# EAGLE design FootSensor (EAGLE 9.6.2)
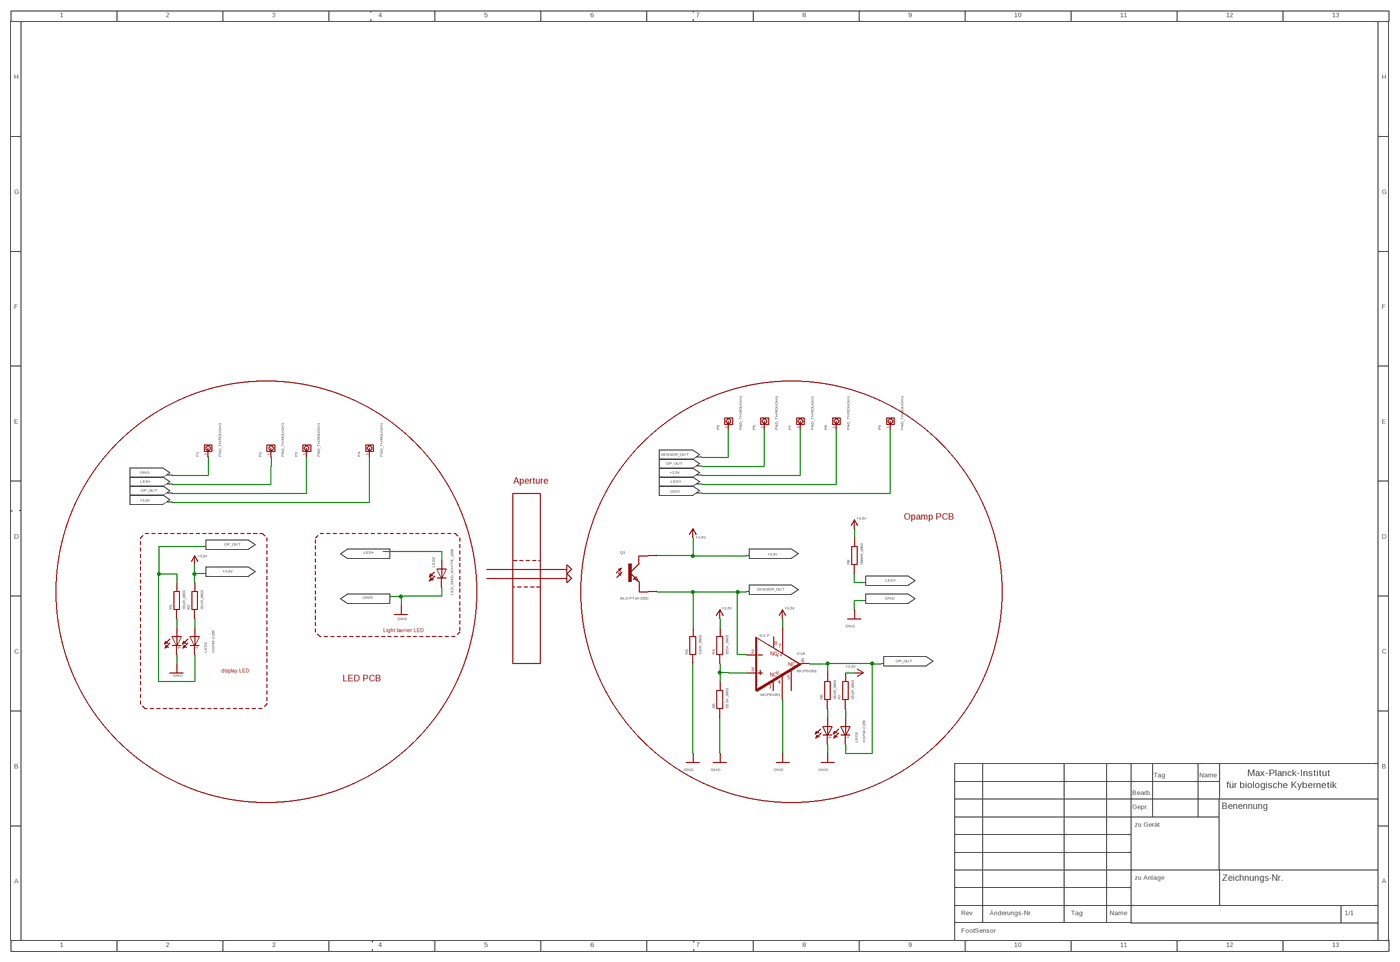
[diagram p0: schematic, sheet 1, overview]
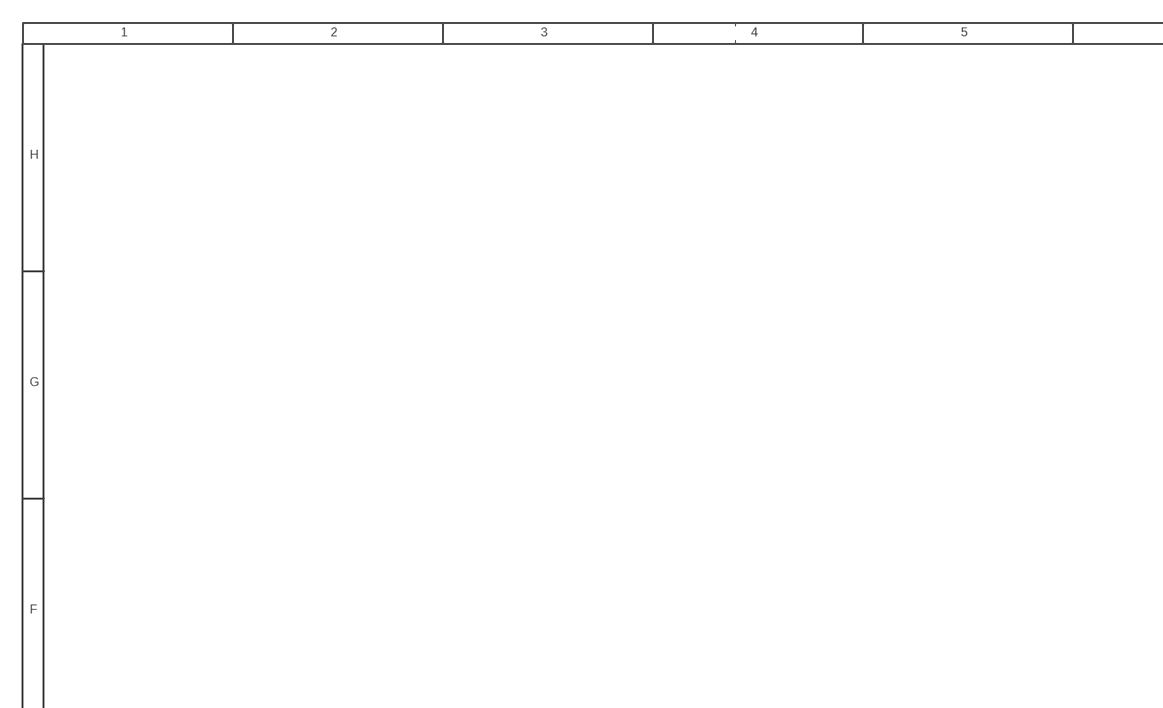
[diagram p1: schematic, sheet 1, part 1 of 4]
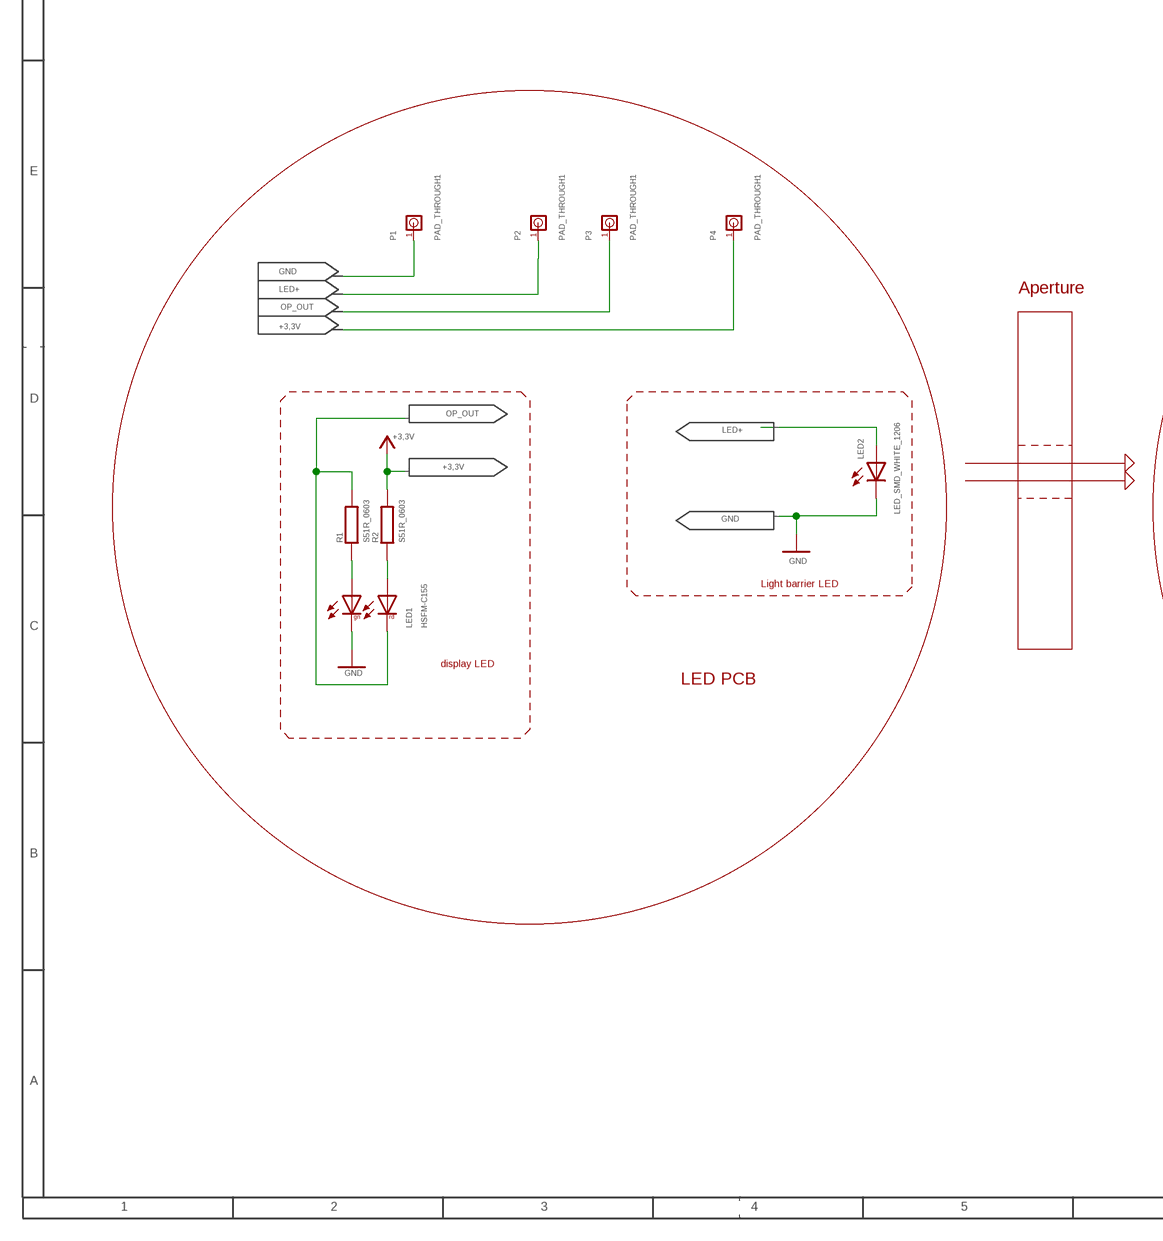
[diagram p2: schematic, sheet 1, part 2 of 4]
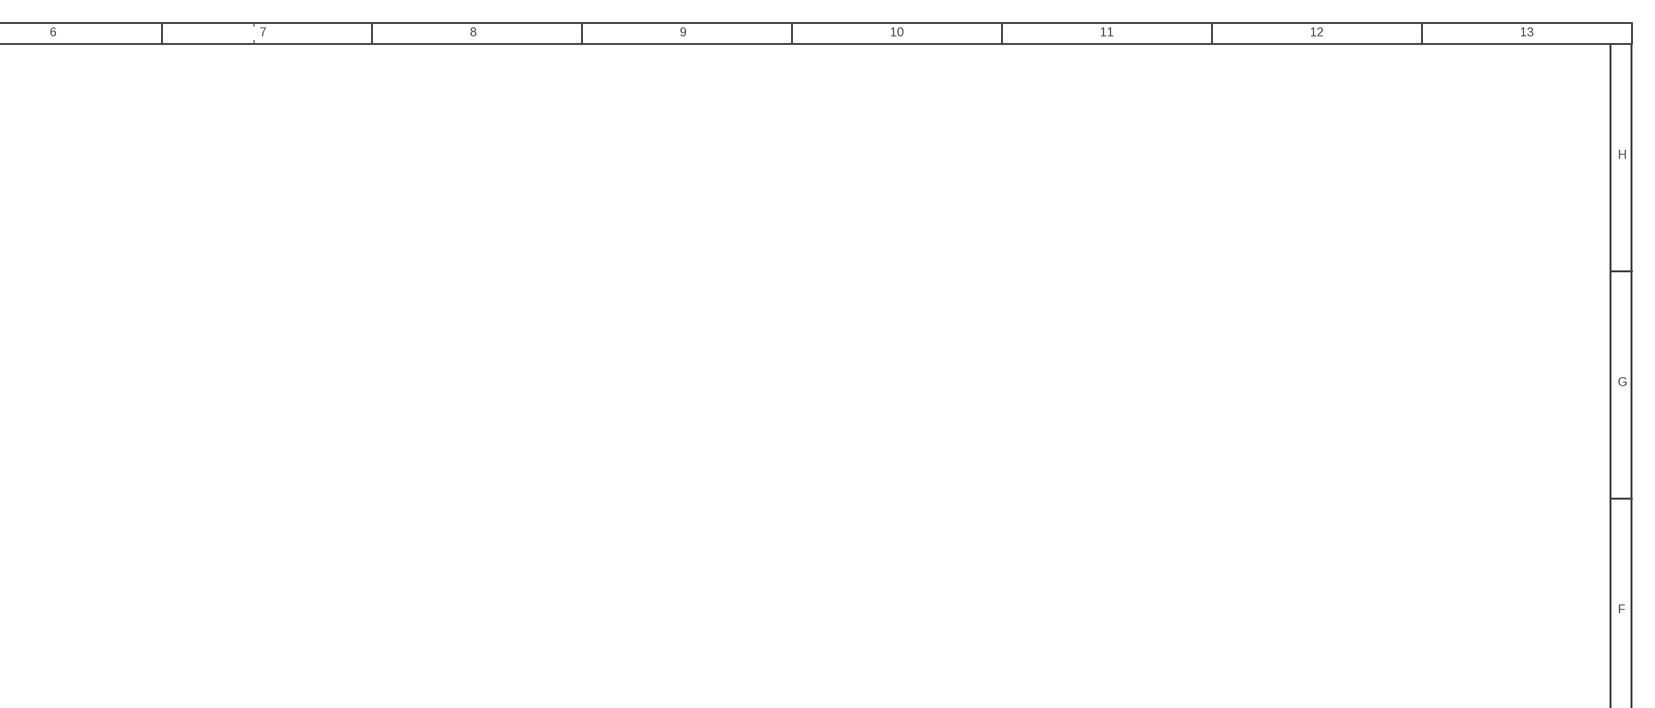
[diagram p3: schematic, sheet 1, part 3 of 4]
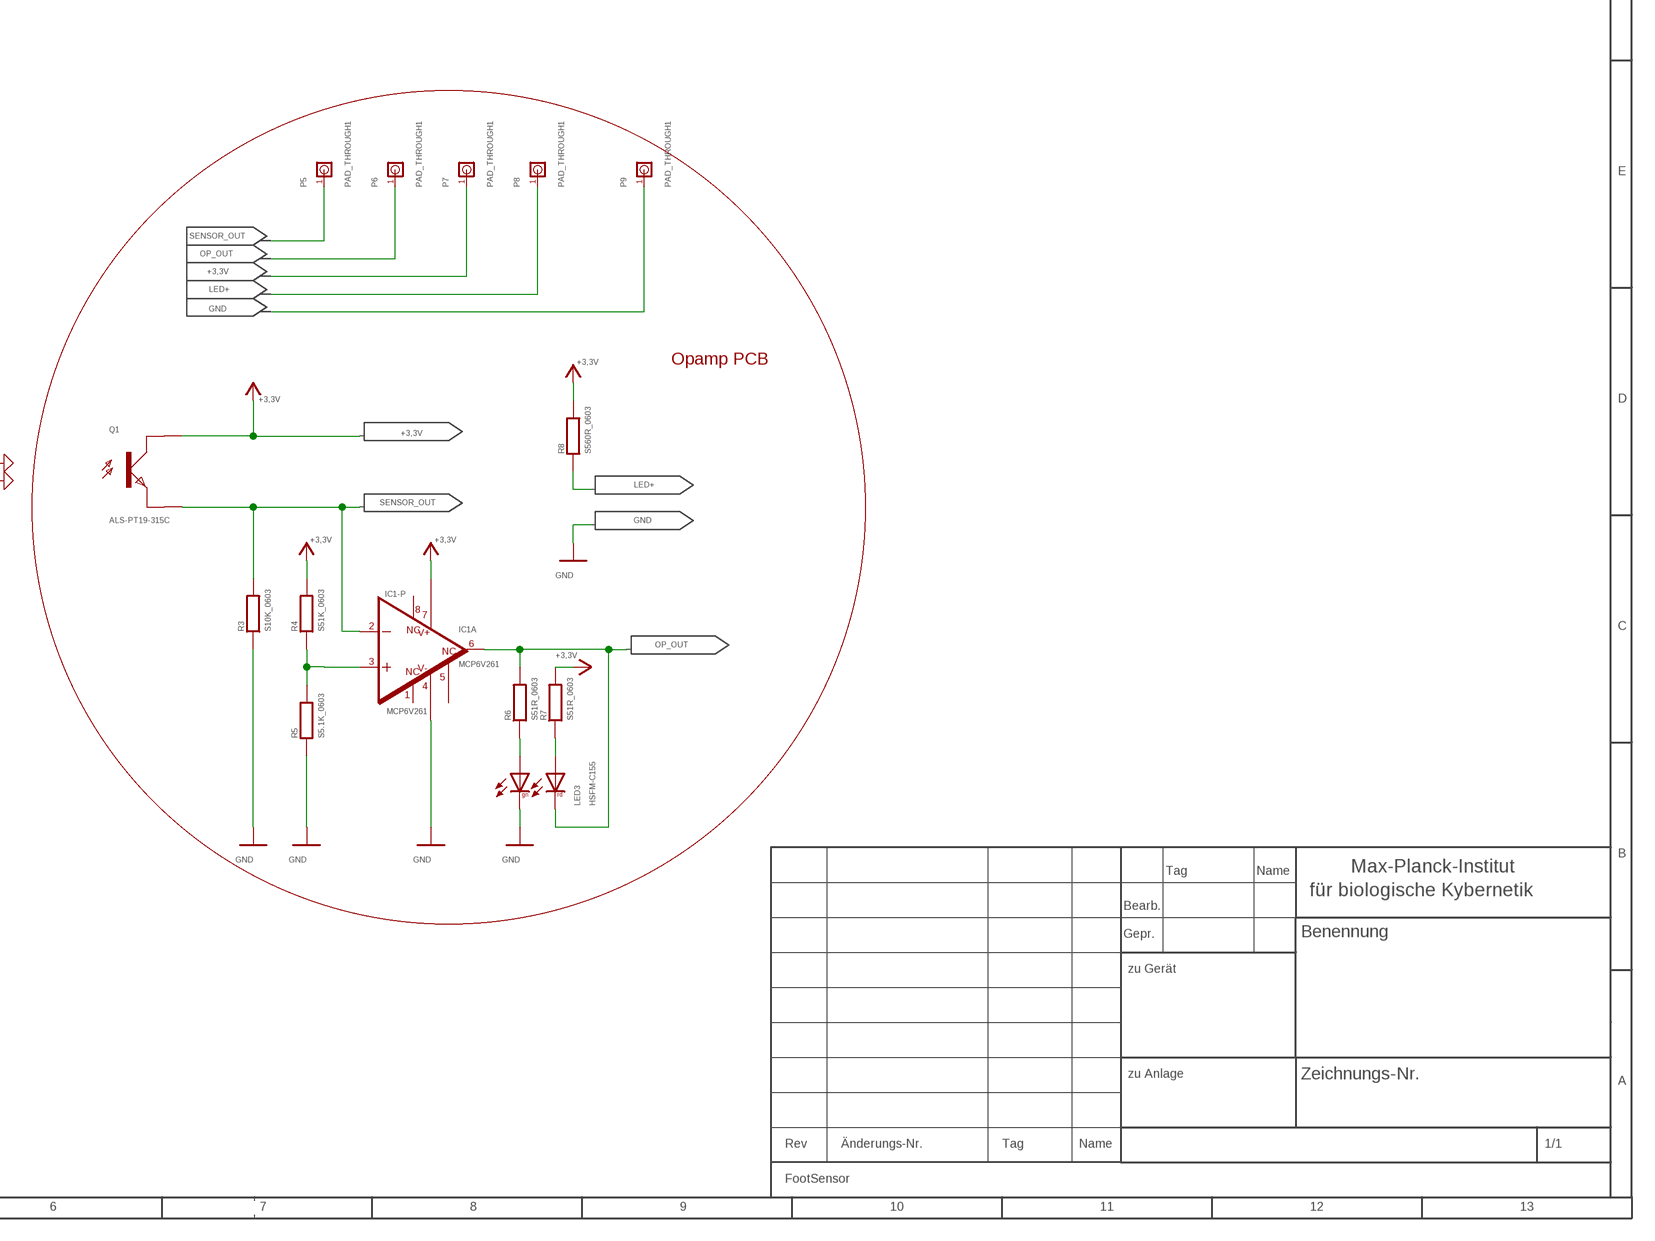
[diagram p4: schematic, sheet 1, part 4 of 4]

## Parts
IC1  MCP6V261  [MSOP8]
LED1  HSFM-C155  [3225]
LED2  LED_SMD_WHITE_1206  [1206C]
LED3  HSFM-C155  [3225]
P1  PAD_THROUGH1  [PAD_TH_056X055]
P2  PAD_THROUGH1  [PAD_TH_056X055]
P3  PAD_THROUGH1  [PAD_TH_056X055]
P4  PAD_THROUGH1  [PAD_TH_056X055]
P5  PAD_THROUGH1  [PAD_TH_056X055]
P6  PAD_THROUGH1  [PAD_TH_056X055]
P7  PAD_THROUGH1  [PAD_TH_056X055]
P8  PAD_THROUGH1  [PAD_TH_056X055]
P9  PAD_THROUGH1  [PAD_TH_056X055]
Q1  ALS-PT19-315C  [FOTOTRANSISTOR]
R1  S51R_0603  [0603R]
R2  S51R_0603  [0603R]
R3  S10K_0603  [0603R]
R4  S51K_0603  [0603R]
R5  S5.1K_0603  [0603R]
R6  S51R_0603  [0603R]
R7  S51R_0603  [0603R]
R8  S560R_0603  [0603R]

## Nets
+3,3V: IC1.7 P4.P$1 P7.P$1 Q1.1(C) R2.P$2 R4.P$2 R7.P$2 R8.P$2
GND: IC1.4 LED1.2 LED2.-(C1) LED3.2 P1.P$1 P9.P$1 R3.P$1 R5.P$1
LED+: LED2.+(A1) P2.P$1 P8.P$1 R8.P$1
N$1: IC1.3 R4.P$1 R5.P$2
N$3: LED3.1 R6.P$1
N$5: LED3.3 R7.P$1
N$7: LED1.1 R1.P$1
N$8: LED1.3 R2.P$1
OP_OUT: IC1.6 LED1.4 LED3.4 P3.P$1 P6.P$1 R1.P$2 R6.P$2
SENSOR_OUT: IC1.2 P5.P$1 Q1.2(E) R3.P$2
Unconnected: IC1.1 IC1.5 IC1.8

## Notes on the sheet
- Aperture
- Opamp PCB
- Light barrier LED
- display LED
- LED PCB

## Library data of the parts
IC1 = joshi:MCP6V26: SMD OP Amp rail-to-rail part number: MCP6V26-E/MS RS order code: 755-9568 package: MSOP-8 manufacturer: MICROCHIP
LED1 LED3 = joshi:HSFM-C155: SMD dual LED red/green 20mA 2,1V part number: HSMF-C155 Farnell order code: 5790888 package: 3225 manufacturer: AVAGO
LED2 = OPTO_Display:LED_SMD_WHITE_1206: SMD LED White 20mA 3V part number: 158301260 Farnell order code: 2470224 package: 1206 manufacturer: WURTH ELEKTRONIK
P1-P9 = Connectors:PAD_THROUGH: 000000; 000,00; Solder Pad PAD_01 Diameter=56mil, Drill=0.55mm
Q1 = joshi:ALS-PT19-315C: SMD phototransistor part number: ALS-PT19-315C/L177/TR8 Digi-key order code: 1080-1244-1-ND package: 2-SMD manufacturer: EVERLIGHT
R1 R2 R6 R7 = joshi:S51R_0603: SMD resistor 51Ohm part number: MCT06030C5109FP500 Farnell order code: 2614454 package: 0603 manufacturer: VISHAY
R3 = joshi:S10K_0603: SMD resistor 10kOhm part number: RN73C1J10KBTDF Farnell order code: 2613718 package: 0603 manufacturer: TE CONNECTIVITY
R4 = joshi:S51K_0603: SMD resistor 51kOhm part number: RN73C1J10KBTDF Farnell order code: 2613718 package: 0603 manufacturer: TE CONNECTIVITY
R5 = joshi:S5.1K_0603: SMD resistor 5.1kOhm part number: CRCW060320K0FKEA Farnell order code: 1469774 package: 0603 manufacturer: VISHAY
R8 = joshi:S560R_0603: SMD resistor 560Ohm part number: WR06X5600FTL Farnell order code: 2502470 package: 0603 manufacturer: WALSIN

## Board
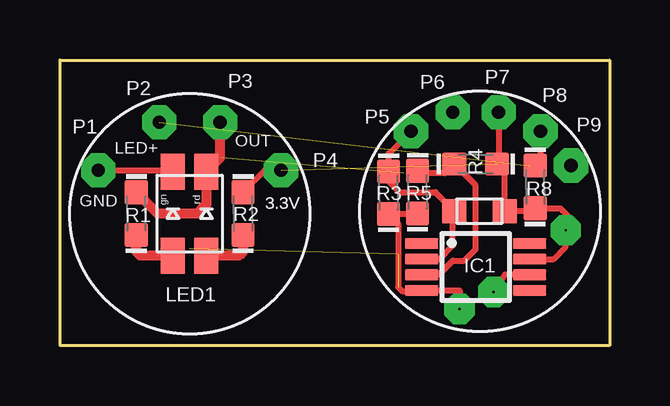
[diagram p5: board, top side]
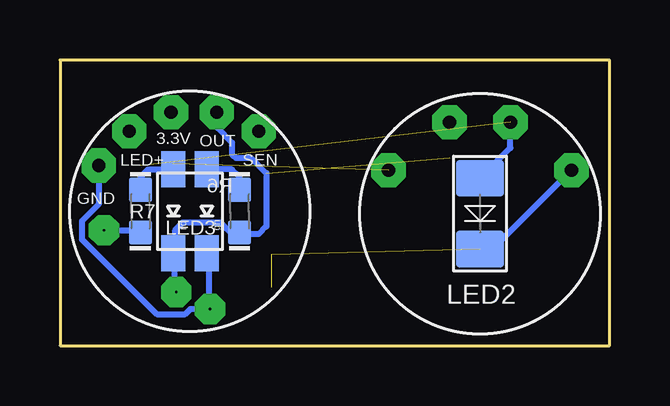
[diagram p6: board, bottom side, seen from below]

Size 22.9 x 11.9 mm. Coordinates in mm from the lower left corner, seen from the top.
Outline: 0,11.9 22.9,11.9 22.9,0 0,0 0,11.9
Copper layers (1*16): Top 0.035mm / dielectric 1.5mm / Bottom 0.035mm
Design rules "default *": minimum track width 10mil, minimum drill 24mil, track to track 6mil, track to pad 6mil, pad to pad 6mil, via to via 6mil, smd to smd 6mil, copper to edge 0mil, drill to drill 8mil, minimum pad ring 10mil, minimum via ring 8mil, stop-mask expansion 4mil, vias tented up to drill 10mil, thermal gap 10mil

### Footprints (pad centres in the part's own frame; a part is rotated, then mirrored left to right if it is on the bottom)
MSOP8 = smd 0.45 x 1.4: 1 -0.975,-2.25; 2 -0.325,-2.25; 3 0.325,-2.25; 4 0.975,-2.25; 5 0.975,2.25; 6 0.325,2.25; 7 -0.325,2.25; 8 -0.975,2.25
3225 = smd 1.5 x 1: 1 -1.75,0.7; 2 1.75,0.7; 3 -1.75,-0.7; 4 1.75,-0.7
1206C = smd 1.524 x 1.981: + -1.473,0; - 1.473,0
PAD_TH_056X055 = drill 0.55 pad 1.422 octagon: P$1 0,0
FOTOTRANSISTOR = smd 1 x 1: 1 -1.05,0; 2 1.05,0
0603R = smd 1.016 x 0.965: P$1 -0.889,0; P$2 0.889,0

### Placement (x,y rotation side)
IC1  17.32,3.28 270 top
LED1  5.4,5.5 90 top
LED2  5.4,5.5 270 bottom
LED3  17.48,5.6 270 bottom
P1  1.59,7.31 180 top
P2  4.13,9.31 180 top
P3  6.67,9.31 180 top
P4  9.21,7.31 180 top
P5  14.62,8.93 90 top
P6  16.37,9.73 90 top
P7  18.27,9.73 0 top
P8  20.02,8.93 90 top
P9  21.29,7.51 90 top
Q1  17.48,5.6 180 top
R1  3.18,5.5 90 top
R2  7.62,5.5 90 top
R3  13.69,6.37 90 top
R4  17.32,7.57 0 top
R5  14.9,6.39 90 top
R6  15.42,5.6 270 bottom
R7  19.54,5.6 270 bottom
R8  19.8,6.61 270 top

### Tracks (layer width: path | path; a pad name or v marks a point on that pad's centre or on a via)
+3,3V  (via drill 0.1 pad 1.27)  (1 unrouted)
  Top 0.254: IC1.7 20.56,3.6 21.07,4.11 v21.07,4.81 21.17,4.91 21.17,5.4 20.85,5.72 R8.P$2 19.68,5.6 Q1.1 18.53,7.25 R4.P$2 18.27,7.63 P7.P$1 | R2.P$2 8.54,7.31 P4.P$1
  Top 0.406: 7.37,6.45 R2.P$2
  Bottom 0.254: v21.07,4.81 19.64,4.81 R7.P$2
GND  (via drill 0.1 pad 1.27)  (2 unrouted)
  Top 0.254: v16.65,1.53 16.65,2.3 IC1.4 15.02,2.25 14.28,2.25 14.09,2.44 14.09,5.08 R3.P$1 14.88,5.48 R5.P$1 | P1.P$1 4.64,7.31 LED1.2
  Bottom 0.254: LED3.2 16.69,3.76 16.69,1.53 v16.65,1.53 17.46,1.53 17.68,1.31 18.87,1.31 21.99,4.43 21.99,5.19 21.29,5.88 P9.P$1 | LED2.- 4.87,4.03 P1.P$1
LED+  (1 unrouted)
  Top 0.254: 19.55,7.5 R8.P$1 20.02,7.72 P8.P$1 19.7,8.62
  Bottom 0.254: LED2.+ 4.13,8.24 P2.P$1
N$1
  Top 0.254: IC1.3 15.79,2.95 16.37,3.54 16.85,3.54 17.32,4.01 17.32,6.68 R4.P$1 16.05,7.19 14.99,7.19 R5.P$2
N$3
  Bottom 0.254: R6.P$1 15.42,7.03 15.73,7.35 LED3.1
N$5
  Bottom 0.254: R7.P$1 19.54,7.03 19.23,7.35 LED3.3
N$7
  Top 0.406: LED1.1 3.34,3.75 3.18,3.91 R1.P$1
N$8
  Top 0.406: R2.P$1 7.62,3.91 7.46,3.75 LED1.3
OP_OUT  (via drill 0.1 pad 1.27)  (1 unrouted)
  Top 0.254: IC1.6 18.54,2.95 v18.06,2.23
  Top 0.406: R1.P$2 4.07,5.5 5.72,5.5 6.1,5.88 LED1.4 6.67,7.82 P3.P$1
  Bottom 0.254: v18.06,2.23 18.12,2.23 18.12,3.38 18.27,3.76 LED3.4 18.12,3.92 18.12,4.81 17.8,5.12 16.21,5.12 15.8,4.71 R6.P$2 15.35,4.65 14.62,4.65 14.31,4.97 14.31,7.19 14.94,7.82 15.58,7.82 15.73,7.98 15.73,8.46 16.37,9.09 P6.P$1
SENSOR_OUT
  Top 0.254: IC1.2 15.8,3.6 16.37,4.17 16.37,5.54 Q1.2 15.64,6.39 14.15,6.39 13.69,6.85 R3.P$2 13.69,8 P5.P$1

### Text on the board
tNames: LED+ | OUT | GND | 3.3V | 3.3V
bNames: 3.3V | SEN | OUT | LED+ | GND